# Altium schematic sheet eBox_Notes.SchDoc: eBox_Notes
size A4; DocumentNumber: 1; SheetNumber: 1; SheetTotal: 9
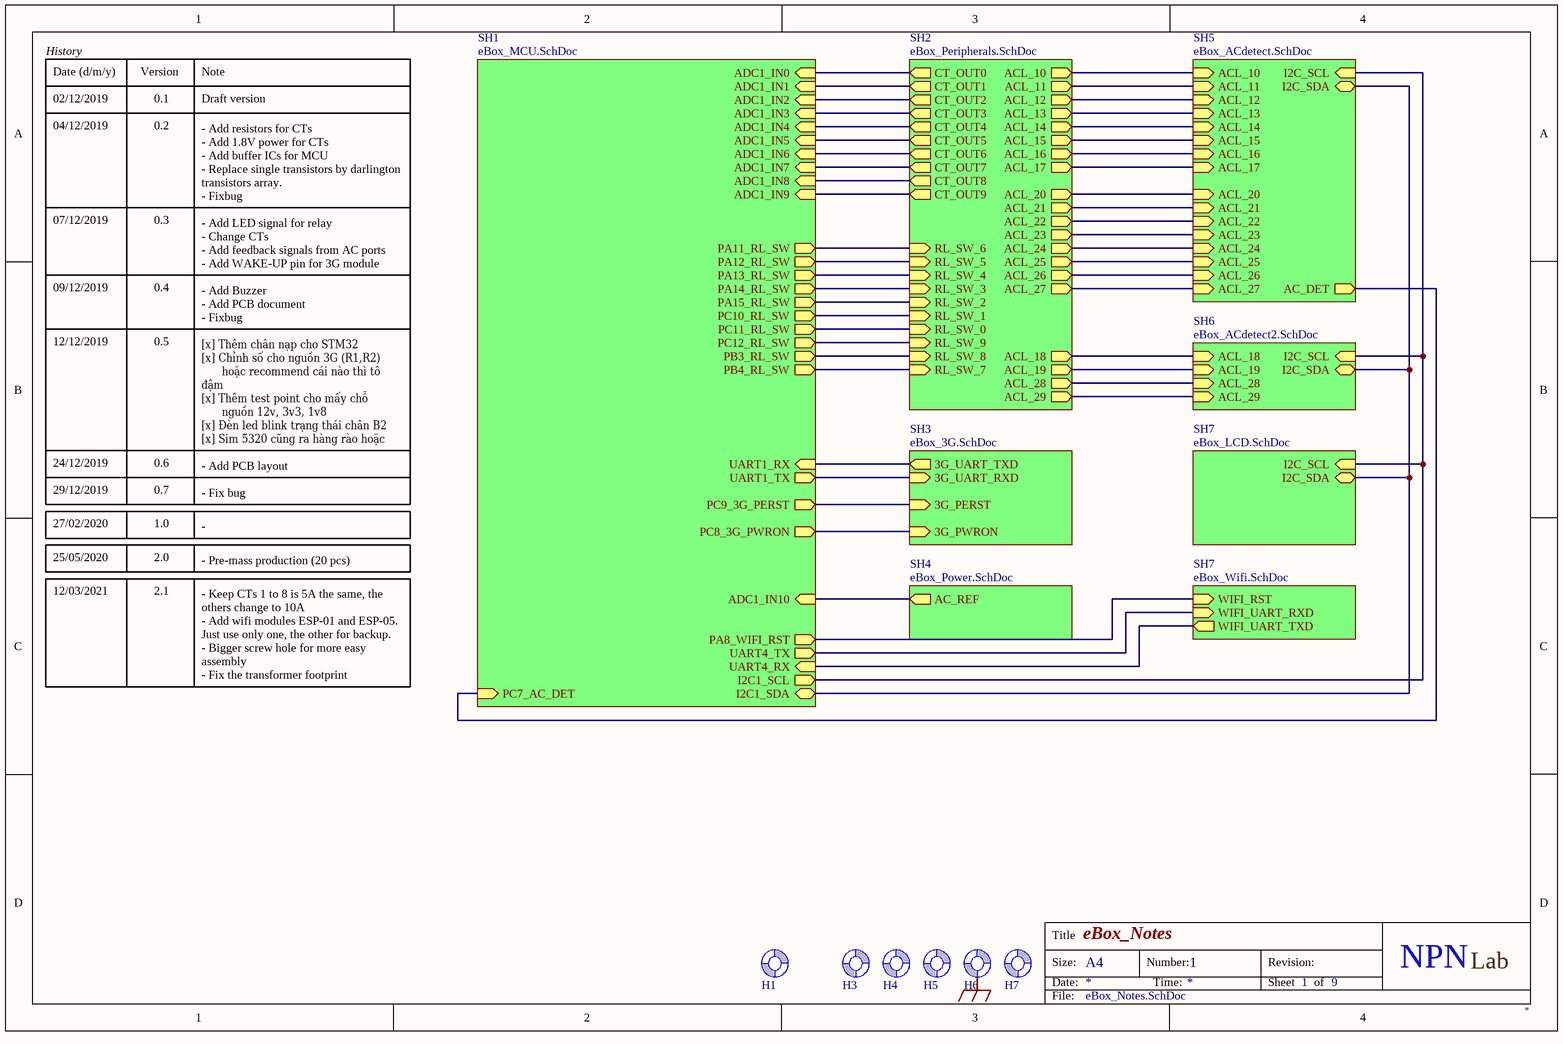
[diagram p0: eBox_Notes.SchDoc]

## Parts
H1  Screw Hole  [SCREW/3.2/7.0/M]  (value not drawn)  (no BOM)
H3  Screw Hole  [SCREW/3.2/7.0/M]  (value not drawn)  (no BOM)
H4  Screw Hole  [SCREW/3.2/7.0/M]  (value not drawn)  (no BOM)
H5  Screw Hole  [SCREW/3.2/7.0/M]  (value not drawn)  (no BOM)
H6  Screw Hole  [SCREW/3.2/7.0/M]  (value not drawn)  (no BOM)
H7  Screw Hole  [SCREW/3.2/7.0/M]  (value not drawn)  (no BOM)

## Sub-sheets
SH1 = eBox_MCU.SchDoc: PC8_3G_PWRON (out), PC9_3G_PERST (out), UART1_RX (in), UART1_TX (out), ADC1_IN0 (in), ADC1_IN1 (in), ADC1_IN2 (in), ADC1_IN3 (in), ADC1_IN4 (in), ADC1_IN5 (in), ADC1_IN6 (in), ADC1_IN9 (in), ADC1_IN7 (in), PA12_RL_SW (out), ADC1_IN8 (in), PA11_RL_SW (out), PA13_RL_SW (out), PA14_RL_SW (out), PA15_RL_SW (out), PC10_RL_SW (out), PC11_RL_SW (out), PB3_RL_SW (out), PB4_RL_SW (out), PC12_RL_SW (out), I2C1_SCL (out), I2C1_SDA (bidir), PC7_AC_DET (in), ADC1_IN10 (in), UART4_RX (in), UART4_TX (out), PA8_WIFI_RST (out)
SH2 = eBox_Peripherals.SchDoc: CT_OUT0 (out), CT_OUT1 (out), CT_OUT2 (out), CT_OUT3 (out), CT_OUT4 (out), CT_OUT5 (out), CT_OUT6 (out), CT_OUT7 (out), CT_OUT8 (out), CT_OUT9 (out), RL_SW_6 (in), RL_SW_5 (in), RL_SW_4 (in), RL_SW_3 (in), RL_SW_2 (in), RL_SW_1 (in), RL_SW_0 (in), RL_SW_9 (in), RL_SW_8 (in), RL_SW_7 (in), ACL_25 (out), ACL_24 (out), ACL_21 (out), ACL_20 (out), ACL_15 (out), ACL_14 (out), ACL_13 (out), ACL_10 (out), ACL_12 (out), ACL_11 (out), ACL_17 (out), ACL_16 (out), ACL_19 (out), ACL_18 (out), ACL_23 (out), ACL_28 (out), ACL_26 (out), ACL_22 (out), ACL_27 (out), ACL_29 (out)
SH3 = eBox_3G.SchDoc: 3G_UART_RXD (in), 3G_PERST (in), 3G_PWRON (in), 3G_UART_TXD (out)
SH4 = eBox_Power.SchDoc: AC_REF (out)
SH5 = eBox_ACdetect.SchDoc: I2C_SDA (bidir), I2C_SCL (in), ACL_16 (in), ACL_14 (in), ACL_15 (in), ACL_13 (in), ACL_11 (in), ACL_10 (in), ACL_12 (in), ACL_25 (in), ACL_24 (in), ACL_27 (in), ACL_26 (in), ACL_23 (in), ACL_22 (in), ACL_21 (in), ACL_20 (in), ACL_17 (in), AC_DET (out)
SH6 = eBox_ACdetect2.SchDoc: I2C_SDA (bidir), I2C_SCL (in), ACL_19 (in), ACL_29 (in), ACL_18 (in), ACL_28 (in)
SH7 = eBox_LCD.SchDoc: I2C_SCL (in), I2C_SDA (bidir)
SH7 = eBox_Wifi.SchDoc: WIFI_UART_TXD (out), WIFI_UART_RXD (in), WIFI_RST (in)

## Nets
GNDEARTH: H6.1(Screw)
(unnamed): sheet SH1/PC8_3G_PWRON, sheet SH3/3G_PWRON
(unnamed): sheet SH1/PC9_3G_PERST, sheet SH3/3G_PERST
(unnamed): sheet SH1/UART1_RX, sheet SH3/3G_UART_TXD
(unnamed): sheet SH1/UART1_TX, sheet SH3/3G_UART_RXD
(unnamed): sheet SH1/ADC1_IN0, sheet SH2/CT_OUT0
(unnamed): sheet SH1/ADC1_IN1, sheet SH2/CT_OUT1
(unnamed): sheet SH1/ADC1_IN2, sheet SH2/CT_OUT2
(unnamed): sheet SH1/ADC1_IN3, sheet SH2/CT_OUT3
(unnamed): sheet SH1/ADC1_IN4, sheet SH2/CT_OUT4
(unnamed): sheet SH1/ADC1_IN5, sheet SH2/CT_OUT5
(unnamed): sheet SH1/ADC1_IN6, sheet SH2/CT_OUT6
(unnamed): sheet SH1/ADC1_IN9, sheet SH2/CT_OUT9
(unnamed): sheet SH1/ADC1_IN7, sheet SH2/CT_OUT7
(unnamed): sheet SH1/PA12_RL_SW, sheet SH2/RL_SW_5
(unnamed): sheet SH1/ADC1_IN8, sheet SH2/CT_OUT8
(unnamed): sheet SH1/PA11_RL_SW, sheet SH2/RL_SW_6
(unnamed): sheet SH1/PA13_RL_SW, sheet SH2/RL_SW_4
(unnamed): sheet SH1/PA14_RL_SW, sheet SH2/RL_SW_3
(unnamed): sheet SH1/PA15_RL_SW, sheet SH2/RL_SW_2
(unnamed): sheet SH1/PC10_RL_SW, sheet SH2/RL_SW_1
(unnamed): sheet SH1/PC11_RL_SW, sheet SH2/RL_SW_0
(unnamed): sheet SH1/PB3_RL_SW, sheet SH2/RL_SW_8
(unnamed): sheet SH1/PB4_RL_SW, sheet SH2/RL_SW_7
(unnamed): sheet SH1/PC12_RL_SW, sheet SH2/RL_SW_9
(unnamed): sheet SH1/I2C1_SCL, sheet SH5/I2C_SCL, sheet SH6/I2C_SCL, sheet SH7/I2C_SCL
(unnamed): sheet SH1/I2C1_SDA, sheet SH5/I2C_SDA, sheet SH6/I2C_SDA, sheet SH7/I2C_SDA
(unnamed): sheet SH1/PC7_AC_DET, sheet SH5/AC_DET
(unnamed): sheet SH1/ADC1_IN10, sheet SH4/AC_REF
(unnamed): sheet SH1/UART4_RX, sheet SH7/WIFI_UART_TXD
(unnamed): sheet SH1/UART4_TX, sheet SH7/WIFI_UART_RXD
(unnamed): sheet SH1/PA8_WIFI_RST, sheet SH7/WIFI_RST
(unnamed): sheet SH2/ACL_25, sheet SH5/ACL_25
(unnamed): sheet SH2/ACL_24, sheet SH5/ACL_24
(unnamed): sheet SH2/ACL_21, sheet SH5/ACL_21
(unnamed): sheet SH2/ACL_20, sheet SH5/ACL_20
(unnamed): sheet SH2/ACL_15, sheet SH5/ACL_15
(unnamed): sheet SH2/ACL_14, sheet SH5/ACL_14
(unnamed): sheet SH2/ACL_13, sheet SH5/ACL_13
(unnamed): sheet SH2/ACL_10, sheet SH5/ACL_10
(unnamed): sheet SH2/ACL_12, sheet SH5/ACL_12
(unnamed): sheet SH2/ACL_11, sheet SH5/ACL_11
(unnamed): sheet SH2/ACL_17, sheet SH5/ACL_17
(unnamed): sheet SH2/ACL_16, sheet SH5/ACL_16
(unnamed): sheet SH2/ACL_19, sheet SH6/ACL_19
(unnamed): sheet SH2/ACL_18, sheet SH6/ACL_18
(unnamed): sheet SH2/ACL_23, sheet SH5/ACL_23
(unnamed): sheet SH2/ACL_28, sheet SH6/ACL_28
(unnamed): sheet SH2/ACL_26, sheet SH5/ACL_26
(unnamed): sheet SH2/ACL_22, sheet SH5/ACL_22
(unnamed): sheet SH2/ACL_27, sheet SH5/ACL_27
(unnamed): sheet SH2/ACL_29, sheet SH6/ACL_29

Not connected (* = marked no-connect by the designer): H1 1(Screw); H3 1(Screw); H4 1(Screw); H5 1(Screw); H7 1(Screw)

## Notes on the sheet
- History
- Date (d/m/y)
- 02/12/2019
- Version
- 0.1
- Note
- Draft version
- 04/12/2019
- 0.2
- 07/12/2019
- 0.3
- - Add resistors for CTs
  - Add 1.8V power for CTs
  - Add buffer ICs for MCU
  - Replace single transistors by darlington  transistors array.
  - Fixbug
- 09/12/2019
- 0.4
- - Add LED signal for relay
  - Change CTs
  - Add feedback signals from AC ports
  - Add WAKE-UP pin for 3G module
- 12/12/2019
- 0.5
- - Add Buzzer
  - Add PCB document
  - Fixbug
- [x] Thêm chân nạp cho STM32
  [x] Chỉnh số cho nguồn 3G (R1,R2)
  hoặc recommend cái nào thì tô đậm
  [x] Thêm test point cho mấy chỗ
  nguồn 12v, 3v3, 1v8
  [x] Đèn led blink trạng thái chân B2
  [x] Sim 5320 cũng ra hàng rào hoặc
  test point uart để test
- 24/12/2019
- 29/12/2019
- 0.6
- 0.7
- - Add PCB layout
- - Fix bug
- 27/02/2020
- 25/05/2020
- 1.0
- 2.0
- -
- - Pre-mass production (20 pcs)
- 12/03/2021
- 2.1
- - Keep CTs 1 to 8 is 5A the same, the others change to 10A
  - Add wifi modules ESP-01 and ESP-05. Just use only one, the other for backup.
  - Bigger screw hole for more easy assembly
  - Fix the transformer footprint
  - Use 5V power supply for the temperature sensor
- Title
- Size:
- Date:
- A4
- Number:
- Time:
- Revision:
- Sheet
- of
- NPN
- Lab
- File:

## Library data of the parts
H1 H3-H7 = Screw Hole: TYPE: NO-BOM; UNIT PRICE: 0